# EAGLE design usb-hub-1b (EAGLE 9.6.2)
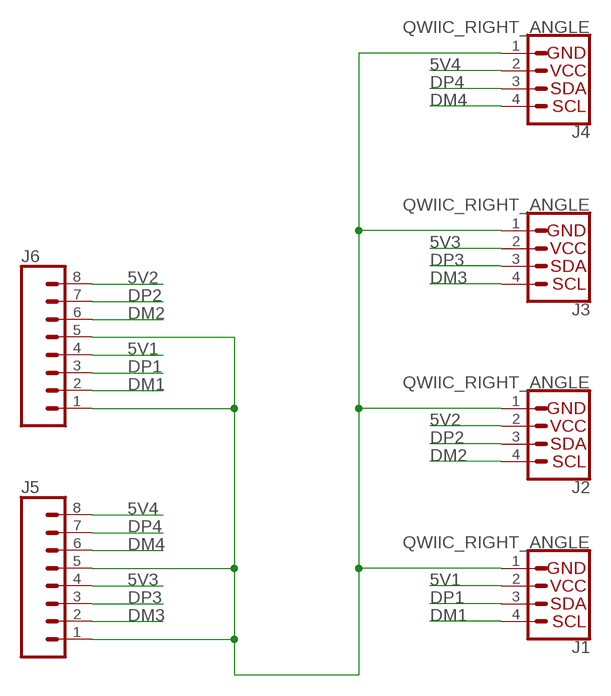
[diagram p0: schematic, sheet 1]

## Parts
J1  QWIIC_RIGHT_ANGLE  QWIIC_CONNECTORJS-1MM  [JST04_1MM_RA]
J2  QWIIC_RIGHT_ANGLE  QWIIC_CONNECTORJS-1MM  [JST04_1MM_RA]
J3  QWIIC_RIGHT_ANGLE  QWIIC_CONNECTORJS-1MM  [JST04_1MM_RA]
J4  QWIIC_RIGHT_ANGLE  QWIIC_CONNECTORJS-1MM  [JST04_1MM_RA]
J5  CONN_08LOCK  [1X08_LOCK]
J6  CONN_08LOCK  [1X08_LOCK]

## Nets
5V1: J1.2 J6.4
5V2: J2.2 J6.8
5V3: J3.2 J5.4
5V4: J4.2 J5.8
DM1: J1.4 J6.2
DM2: J2.4 J6.6
DM3: J3.4 J5.2
DM4: J4.4 J5.6
DP1: J1.3 J6.3
DP2: J2.3 J6.7
DP3: J3.3 J5.3
DP4: J4.3 J5.7
GND: J1.1 J2.1 J3.1 J4.1 J5.1 J5.5 J6.1 J6.5

## Library data of the parts
J1-J4 = SparkFun-Connectors:QWIIC_CONNECTOR: SparkFun I2C Standard Qwiic Connector An SMD 1mm pitch JST connector makes it easy and quick (get it? Qwiic?) to connect I2C devices to each other. The Qwiic system <http://www.sparkfun.com/qwiic> enables fast and solderless connection between popular platforms and various sensors and actuators. We carry 200mm <https://www.sparkfun.com/products/14204>, 100mm <https://www.sparkfun.com/products/14205>, 50mm <https://www.sparkfun.com/products/14206>, and breadboard friendly <https://www.sparkfun.com/products/14207> Qwiic cables. We also offer 10 pcs strips <https://www.sparkfun.com/products/14323> the SMD connectors.; PROD_ID: CONN-13694
J5 J6 = SparkFun-Connectors:CONN_08: Multi connection point. Often used as Generic Header-pin footprint for 0.1 inch spaced/style header connections On any of the 0.1 inch spaced packages, you can populate with these: Break Away Headers - Straight <https://www.sparkfun.com/products/116> (PRT-00116) Break Away Male Headers - Right Angle <https://www.sparkfun.com/products/553> (PRT-00553) Female Headers <https://www.sparkfun.com/products/115> (PRT-00115) Break Away Headers - Machine Pin <https://www.sparkfun.com/products/117> (PRT-00117) Break Away Female Headers - Swiss Machine Pin <https://www.sparkfun.com/products/743> (PRT-00743) Arduino Stackable Header - 8 Pin <https://www.sparkfun.com/products/9279> (PRT-09279) For SCREWTERMINALS and SPRING TERMINALS visit here: Screw Terimnals on SparkFun.com <https://www.sparkfun.com/search/results?term=Screw+Terminals> (5mm/3.5mm/2.54mm spacing) This device is also useful as a general connection point to wire up your design to another part of your project. Our various solder wires solder well into these plated through hole pads. Hook-Up Wire - Assortment (Stranded, 22 AWG) <https://www.sparkfun.com/products/11375> (PRT-11375) Hook-Up Wire - Assortment (Solid Core, 22 AWG) <https://www.sparkfun.com/products/11367> (PRT-11367) View the entire wire category on our website here <https://www.sparkfun.com/categories/141> Special notes: Molex polarized connector foot print use with SKU : PRT-08231 with associated crimp pins and housings. 1MM SMD Version SKU: PRT-10208 NOTES ON THE VARIANTS LOCK and LOCK_LONGPADS... This footprint was designed to help hold the alignment of a through-hole component (i.e. 6-pin header) while soldering it into place. You may notice that each hole has been shifted either up or down by 0.005 of an inch from it's more standard position (which is a perfectly straight line). This slight alteration caused the pins (the squares in the middle) to touch the edges of the holes. Because they are alternating, it causes a "brace" to hold the component in place. 0.005 has proven to be the perfect amount of "off-center" position when using our standard breakaway headers. Although looks a little odd when you look at the bare footprint, once you have a header in there, the alteration is very hard to notice. Also,if you push a header all the way into place, it is covered up entirely on the bottom side.

## Board
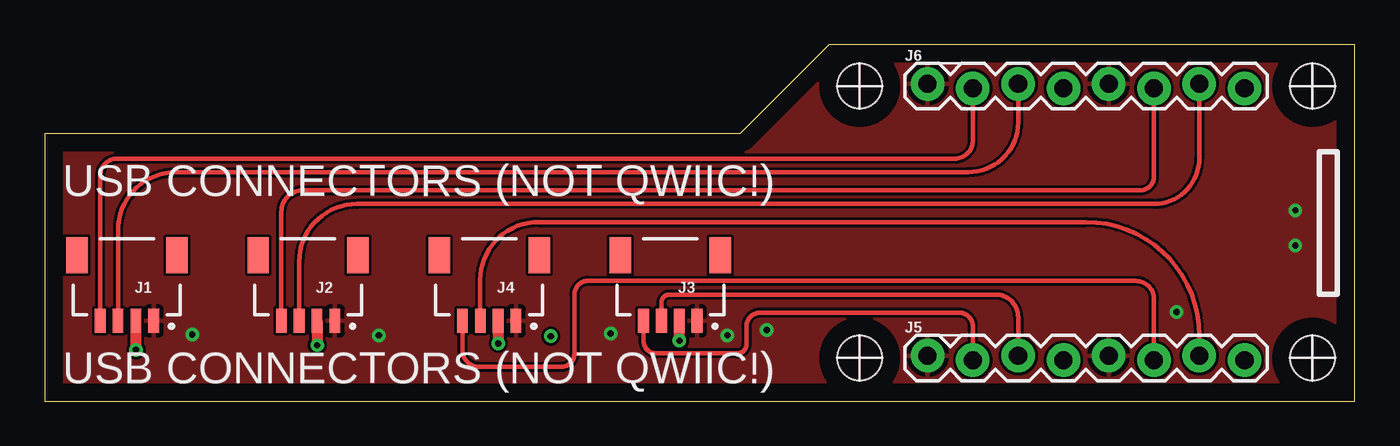
[diagram p1: board, top side]
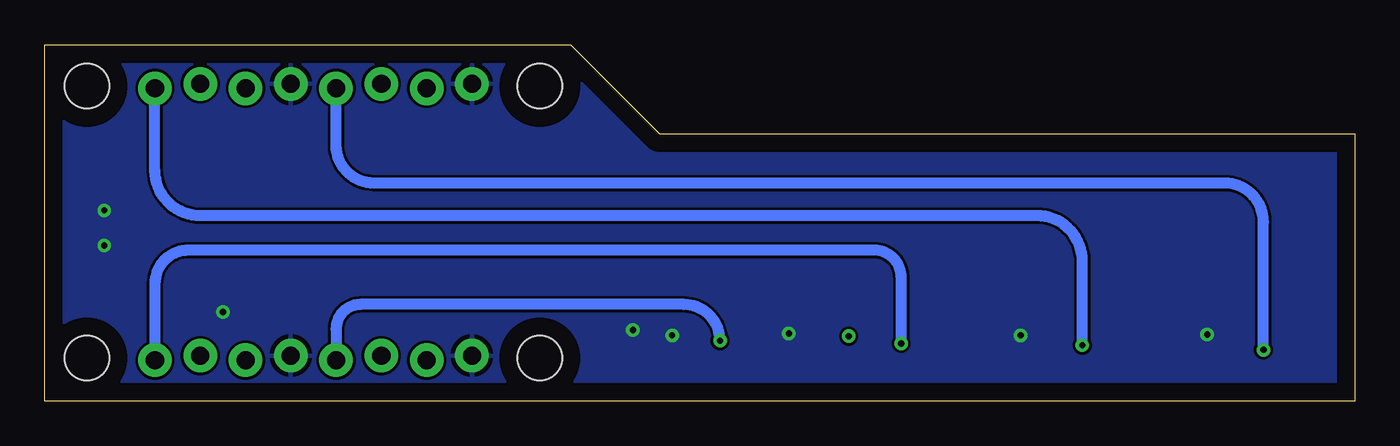
[diagram p2: board, bottom side, seen from below]

Size 73.5 x 20 mm. Coordinates in mm from the lower left corner, seen from the top.
Outline: 0,0 73.5,0 73.5,20 44,20 39,15 0,15 0,0
Copper layers (1*16): Top 0.035mm / dielectric 1.5mm / Bottom 0.035mm
Design rules "default": minimum track width 6mil, minimum drill 0.35mm, track to track 6mil, track to pad 6mil, pad to pad 6mil, via to via 6mil, smd to smd 6mil, copper to edge 40mil, drill to drill 6mil, minimum pad ring 10mil, minimum via ring 8mil, stop-mask expansion 4mil, vias tented up to drill 0mil, thermal gap 10mil
Holes 2.5 mm at 45.72,17.67 71.12,17.67 71.12,2.43 45.72,2.43

### Footprints (pad centres in the part's own frame; a part is rotated, then mirrored left to right if it is on the bottom)
JST04_1MM_RA = smd 0.6 x 1.35: 1 -1.5,0; 2 -0.5,0; 3 0.5,0; 4 1.5,0 | smd 1.2 x 2: NC1 2.8,-3.675; NC2 -2.8,-3.675
1X08_LOCK = drill 1.016 pad 1.88: 1 0,0.127; 2 2.54,-0.127; 3 5.08,0.127; 4 7.62,-0.127; 5 10.16,0.127; 6 12.7,-0.127; 7 15.24,0.127; 8 17.78,-0.127

### Placement (x,y rotation side)
J1  4.62,4.51 180 top
J2  14.78,4.51 180 top
J3  35.1,4.51 180 top
J4  24.94,4.51 180 top
J5  49.53,2.43 0 top
J6  49.53,17.67 0 top

### Tracks (layer width: path | path; a pad name or v marks a point on that pad's centre or on a via)
5V1  (via drill 0.35)
  Top 0.61: J1.2 v5.12,2.9 arc90 v5.13,2.89
  Bottom 0.61: v5.13,2.89 5.13,10.05 arc-90 7.32,12.23 55.02,12.23 arc90 57.15,14.37 J6.4
5V2  (via drill 0.35)
  Top 0.61: J2.2 15.28,3.15 arc90 v15.29,3.14
  Bottom 0.61: v15.29,3.14 15.29,7.87 arc-90 17.83,10.41 64.77,10.41 arc90 67.31,12.95 J6.8
5V3  (via drill 0.35)
  Top 0.61: J3.2 v35.6,3.41 arc90 v35.61,3.39
  Bottom 0.61: v35.61,3.39 arc-90 37.64,5.43 55.78,5.43 arc-90 57.15,4.06 J5.4
5V4  (via drill 0.35)
  Top 0.61: J4.2 arc-90 25.45,4.5 v25.45,3.24
  Bottom 0.61: v25.45,3.24 25.45,6.95 arc-90 26.98,8.48 65.43,8.48 arc-90 67.31,6.6 J5.8
DM1
  Top 0.254: J1.4 3.12,12.66 arc-90 4.06,13.61 51.05,13.61 arc90 52.07,14.62 J6.2
DM2
  Top 0.254: J6.6 62.23,12.59 arc-90 61.47,11.83 14.48,11.83 arc90 13.28,10.63 J2.4
DM3
  Top 0.254: J5.2 52.07,4.21 arc90 51.31,4.97 40.13,4.97 arc90 39.37,4.21 39.37,3.19 arc-90 38.86,2.68 34.29,2.68 arc-90 33.6,3.37 J3.4
DM4
  Top 0.254: J5.6 62.23,5.73 arc90 61.21,6.75 30.48,6.75 arc90 29.72,5.99 29.72,2.68 arc-90 28.96,1.92 24.38,1.92 arc-90 23.44,2.87 J4.4
DP1
  Top 0.254: J1.3 4.12,9.6 arc-90 7.37,12.84 51.82,12.84 arc90 54.61,15.64 J6.3
DP2
  Top 0.254: J2.3 14.28,7.82 arc-90 17.53,11.07 62.23,11.07 arc90 64.77,13.61 J6.7
DP3
  Top 0.254: J5.3 54.61,4.72 arc90 53.34,5.99 35.05,5.99 arc90 34.6,5.53 J3.3
DP4
  Top 0.254: J5.7 64.77,3.7 arc90 58.42,10.05 27.69,10.05 arc90 24.44,6.8 J4.3
GND  (via drill 0.35)
  other vias: 38.3,3.7 31.75,3.8 18.75,3.7 8.28,3.75 70.15,10.71 70.15,8.73 63.5,5 40.5,4
  pour Top: 0,0 0,15 39,15 44,20 73,20 74,20 74,0
  pour Bottom: 0,0 0,15 39,15 44,20 74,20 74,0
N$3  (via drill 0.35)
  other vias: 28.4,3.65

### Text on the board
tPlace: USB CONNECTORS (NOT QWIIC!) | USB CONNECTORS (NOT QWIIC!)